# Altium schematic sheet USB.SchDoc
size A4; SheetNumber: 3; SheetTotal: 8
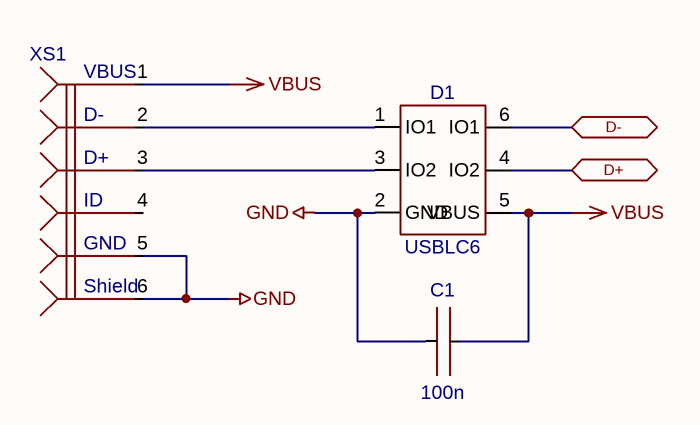
[diagram p0: USB.SchDoc]

## Parts
C1  100n  [CAPC1608X09N]
D1  USBLC6  [STM SOT23-6L]
XS1  MOLEX 1050170001  [MOLEX 1050170001]  (value not drawn)

## Ports
D+ (bidir), D- (bidir)

## Nets
GND: C1.1 D1.2(GND) XS1.5(GND) XS1.6(SHIELD)
VBUS: C1.2 D1.5(VBUS) XS1.1(VBUS)
D+: D1.4(IO2) ; port D+
D-: D1.6(IO1) ; port D-
NetD1_1: D1.1(IO1) XS1.2(D-)
NetD1_3: D1.3(IO2) XS1.3(D+)

Not connected (* = marked no-connect by the designer): XS1 4(ID)

## Notes on the sheet
- (in symbol MOLEX 1050170001) Shield

## Library data of the parts
C1 = C0603-100n-25V-X7R-10%: GRM188R71E104KA01D
D1 = USBLC6-2SC6